# Altium project PCB_Project1.PrjPCB
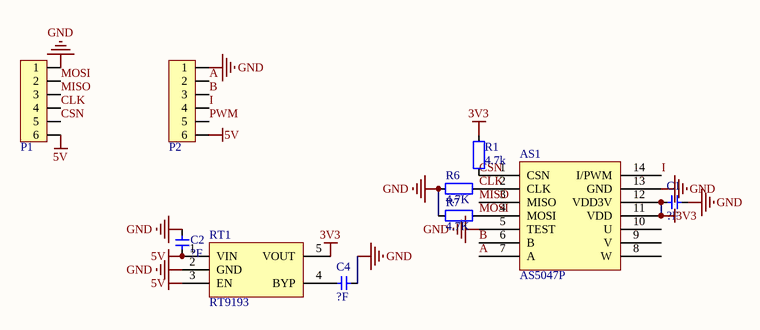
[diagram p0: Sheet.SchDoc]
1 sheet, 10 parts. Net scope: global (net labels, ports and power ports of the same name join across sheets).
Board file: PCB1.PcbDoc

## Sheet Sheet.SchDoc
size A4

### Parts
AS1  AS5047P  [AS5047P]
C1  value ?F  [CAP_0603]  (hidden comment: Cap_0603)
C2  value ?F  [CAP_0603]  (hidden comment: Cap_0603)
C4  value ?F  [CAP_0603]  (hidden comment: Cap_0603)
P1  HDR1x6_2.54  [1.25mm_1X6_SMT]  (value not drawn)
P2  HDR1x6_2.54  [1.25mm_1X6_SMT]  (value not drawn)
R1  value 4.7k  [RES_0603]  (hidden comment: Res_0603)
R6  value 4.7K  [RES_0603]  (hidden comment: Res_0603)
R7  value 4.7K  [RES_0603]  (hidden comment: Res_0603)
RT1  RT9193  [SOT23-5]

### Nets
3V3: AS1.11(VDD) AS1.12(VDD3V) C1.1 R1.2 RT1.5(VOUT)
5V: C2.2 P1.6 P2.6 RT1.1(VIN) RT1.3(EN)
GND: AS1.5(TEST) AS1.13(GND) C1.2 C2.1 C4.1 P1.1 P2.1 R6.2 R7.2 RT1.2(GND)
A: AS1.7(A) P2.2
B: AS1.6(B) P2.3
CLK: AS1.2(CLK) P1.4 R6.1
CSN: AS1.1(CSN) P1.5 R1.1
I: AS1.14(I/PWM) P2.4
MISO: AS1.3(MISO) P1.3
MOSI: AS1.4(MOSI) P1.2 R7.1
PWM: P2.5
NetC4_2: C4.2 RT1.4(BYP)

Not connected (* = marked no-connect by the designer): AS1 8(W) 9(V) 10(U)

### Library data of the parts
C1 C2 C4 = Cap_0603: Capacitor
P1 P2 = HDR1x6_2.54T: Header
R1 R6 R7 = Res_0603: Resistor
RT1 = RT9193: Power